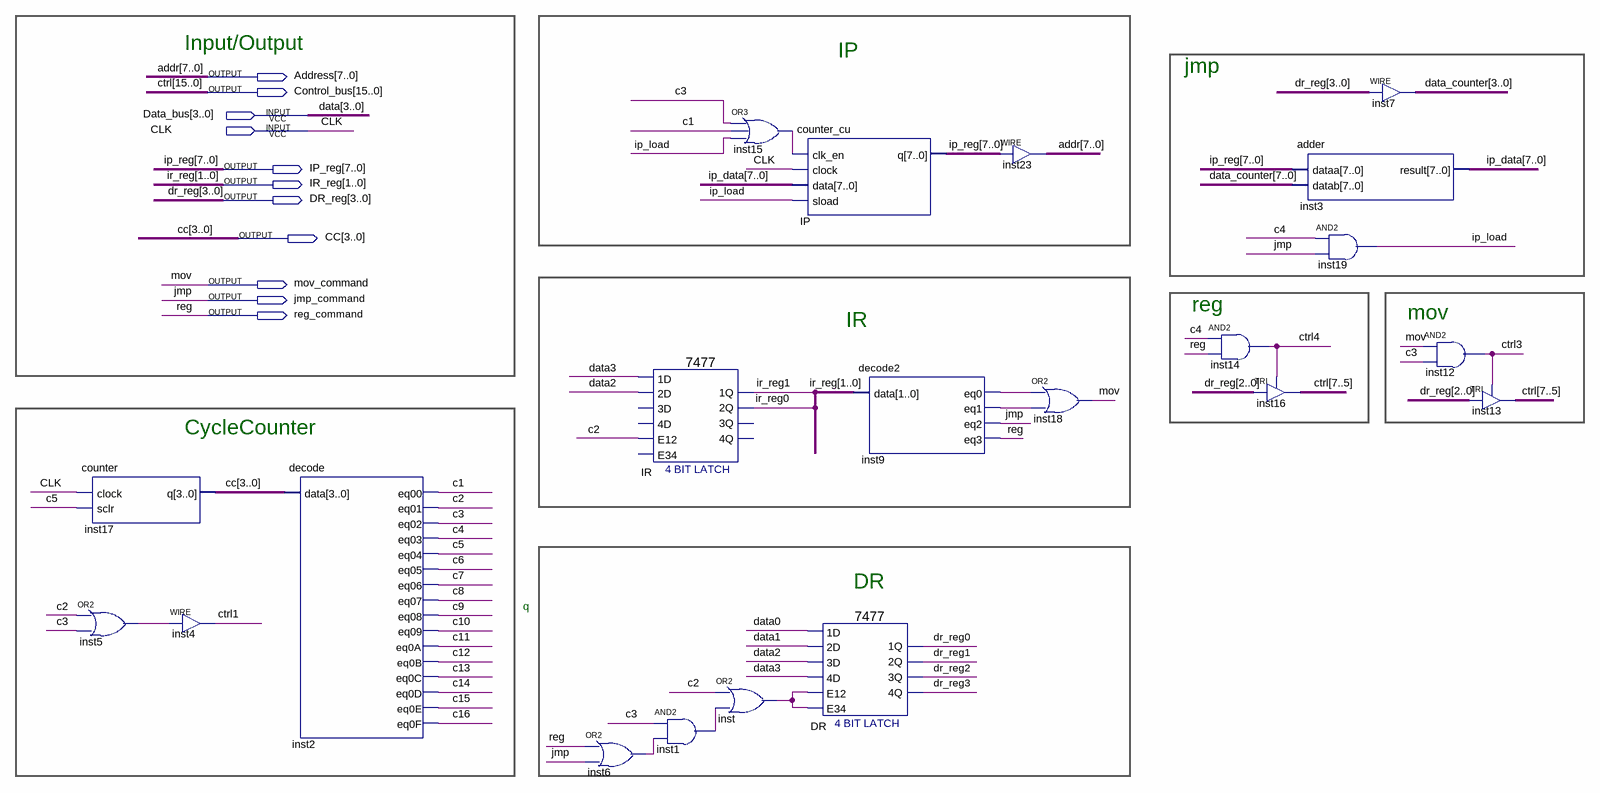
[diagram p0: schematic sheet]
// Quartus schematic CU.bdf as structural Verilog: 21 symbols, 11 pins
module CU (
  input  [3:0] Data_bus,
  input  CLK,
  output [7:0] Address,
  output [15:0] Control_bus,
  output [7:0] IP_reg,
  output [1:0] IR_reg,
  output [3:0] DR_reg,
  output [3:0] CC,
  output mov_command,
  output jmp_command,
  output reg_command
);

  wire c1, c2, c3, c4, c5, c6, c7, c8, c9, c10, c11, c12, c13, c14, c15, c16, inst1_out, inst5_out,
       inst6_out, inst9_eq0, inst9_eq1, inst15_out, inst_out, ip_load;
  wire [7:0] data_counter, ip_data;

  counter inst17 (.clock(CLK), .sclr(c5), .q(CC));
  or inst5 (inst5_out, c2, c3);
  assign Control_bus[1] = inst5_out;  // WIRE inst4
  decode inst2 (
    .data(CC), .eq00(c1), .eq01(c2), .eq02(c3), .eq03(c4), .eq04(c5), .eq05(c6), .eq06(c7), .eq07(c8),
    .eq08(c9), .eq09(c10), .eq0A(c11), .eq0B(c12), .eq0C(c13), .eq0D(c14), .eq0E(c15), .eq0F(c16));
  or inst6 (inst6_out, reg_command, jmp_command);
  \7477  IR (
    .\1D (Data_bus[3]), .\2D (Data_bus[2]), .E12(c2), .\2Q (IR_reg[0]), .\1Q (IR_reg[1]));  // open: 3D, E34, 4D, 4Q, 3Q
  and inst1 (inst1_out, c3, inst6_out);
  or inst15 (inst15_out, c3, c1, ip_load);
  or inst (inst_out, c2, inst1_out);
  counter_cu IP (.clk_en(inst15_out), .clock(CLK), .data(ip_data), .sload(ip_load), .q(IP_reg));
  decode2 inst9 (.data(IR_reg), .eq0(inst9_eq0), .eq1(inst9_eq1), .eq2(jmp_command), .eq3(reg_command));
  \7477  DR (
    .\1D (Data_bus[0]), .\2D (Data_bus[1]), .\3D (Data_bus[2]), .E34(inst_out), .E12(inst_out),
    .\4D (Data_bus[3]), .\4Q (DR_reg[3]), .\3Q (DR_reg[2]), .\2Q (DR_reg[1]), .\1Q (DR_reg[0]));
  assign Address = IP_reg;  // WIRE inst23
  or inst18 (mov_command, inst9_eq0, inst9_eq1);
  and inst14 (Control_bus[4], c4, reg_command);
  adder inst3 (.dataa(IP_reg), .datab(data_counter), .result(ip_data));
  TRI inst16[2:0] (.IN(DR_reg[2:0]), .OE(Control_bus[4]), .OUT(Control_bus[7:5]));
  and inst19 (ip_load, c4, jmp_command);
  assign data_counter[3:0] = DR_reg;  // WIRE inst7
  and inst12 (Control_bus[3], mov_command, c3);
  TRI inst13[2:0] (.IN(DR_reg[2:0]), .OE(Control_bus[3]), .OUT(Control_bus[7:5]));

  // Other names for the same wires on the sheet: addr[7:0] = Address; ctrl[15:0] = Control_bus;
  //   ctrl1 = Control_bus[1]; ctrl3 = Control_bus[3]; ctrl4 = Control_bus[4]; data[3:0] = Data_bus;
  //   data0 = Data_bus[0]; data1 = Data_bus[1]; data2 = Data_bus[2]; data3 = Data_bus[3]; jmp = jmp_command;
  //   mov = mov_command; reg = reg_command

  // Notes on the sheet:
  //   Input/Output
  //   IP
  //   jmp
  //   reg
  //   mov
  //   IR
  //   CycleCounter
  //   DR
  //   q
endmodule
